# EAGLE schematic AkPlat2 (EAGLE 9.6.2)
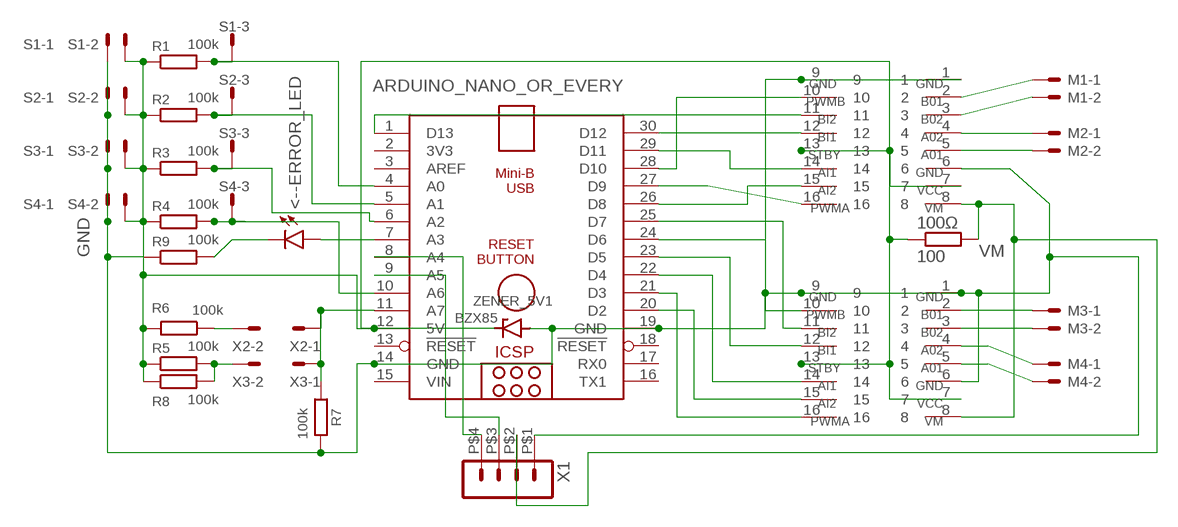
[diagram p0: schematic, sheet 1]

## Parts
100Ω  100  R-EU_0204/7  [0204/7]
<--ERROR_LED  LED3MM  [LED3MM]
ARDUINO_NANO_OR_EVERY  ARDUINO_NANO  [ARDUINO_NANO]
M1  22-23-2021  [22-23-2021]
M2  22-23-2021  [22-23-2021]
M3  22-23-2021  [22-23-2021]
M4  22-23-2021  [22-23-2021]
R1  100k  R-EU_R0402  [R0402]
R2  100k  R-EU_R0402  [R0402]
R3  100k  R-EU_R0402  [R0402]
R4  100k  R-EU_R0402  [R0402]
R5  100k  R-EU_R0402  [R0402]
R6  100k  R-EU_R0402  [R0402]
R7  100k  R-EU_R0402  [R0402]
R8  100k  R-EU_R0402  [R0402]
R9  100k  R-EU_R0402  [R0402]
S1  22-23-2031  [22-23-2031]
S2  22-23-2031  [22-23-2031]
S3  22-23-2031  [22-23-2031]
S4  22-23-2031  [22-23-2031]
U$1  CONTROLLER  [CONTROLLER]
U$2  CONTROLLER  [CONTROLLER]
X1  HEADER_POS4_43045-0412  [43045-0412]
X2  332-02  [332-02]
X3  332-02  [332-02]
ZENER_5V1  BZX85  [DO41Z10]

## Nets
5V: 100Ω.1 ARDUINO_NANO_OR_EVERY.12(5V) R1.1 R2.1 R3.1 R4.1 R5.1 R6.2 R8.1 S1.2 S2.2 S3.2 S4.2 U$1.7 U$1.13 U$2.7 U$2.13 ZENER_5V1.C
BIN2: ARDUINO_NANO_OR_EVERY.1(D13) U$1.11
GND: ARDUINO_NANO_OR_EVERY.14(GND) ARDUINO_NANO_OR_EVERY.19(GND) R7.2 R9.1 S1.1 S2.1 S3.1 S4.1 U$1.1 U$1.6 U$1.9 U$2.1 U$2.6 U$2.9 X1.P$1 ZENER_5V1.A
N$1: ARDUINO_NANO_OR_EVERY.8(A4) X1.P$4
N$2: ARDUINO_NANO_OR_EVERY.9(A5) X1.P$3
N$3: ARDUINO_NANO_OR_EVERY.27(D9) U$1.16
N$4: ARDUINO_NANO_OR_EVERY.25(D7) U$2.11
N$5: ARDUINO_NANO_OR_EVERY.30(D12) U$1.12
N$6: ARDUINO_NANO_OR_EVERY.28(D10) U$1.10
N$7: ARDUINO_NANO_OR_EVERY.29(D11) U$1.14
N$8: ARDUINO_NANO_OR_EVERY.11(A7) R7.1 X2.1 X3.1
N$9: ARDUINO_NANO_OR_EVERY.26(D8) U$1.15
N$10: ARDUINO_NANO_OR_EVERY.24(D6) U$2.10
N$11: ARDUINO_NANO_OR_EVERY.21(D3) U$2.16
N$12: ARDUINO_NANO_OR_EVERY.20(D2) U$2.15
N$13: ARDUINO_NANO_OR_EVERY.22(D4) U$2.14
N$14: ARDUINO_NANO_OR_EVERY.23(D5) U$2.12
N$15: R6.1 X2.2
N$16: M1.1 U$1.2
N$17: M1.2 U$1.3
N$18: M2.1 U$1.4
N$19: M2.2 U$1.5
N$20: M3.1 U$2.2
N$21: M3.2 U$2.3
N$22: M4.1 U$2.4
N$23: M4.2 U$2.5
N$24: R5.2 R8.2 X3.2
N$25: <--ERROR_LED.A ARDUINO_NANO_OR_EVERY.7(A3)
N$26: <--ERROR_LED.K(C) R9.2
N$32: ARDUINO_NANO_OR_EVERY.10(A6) R4.2 S4.3
N$33: ARDUINO_NANO_OR_EVERY.6(A2) R3.2 S3.3
N$34: ARDUINO_NANO_OR_EVERY.5(A1) R2.2 S2.3
N$35: ARDUINO_NANO_OR_EVERY.4(A0) R1.2 S1.3
VM: 100Ω.2 U$1.8 U$2.8 X1.P$2
Unconnected: ARDUINO_NANO_OR_EVERY.2(3V3) ARDUINO_NANO_OR_EVERY.3(AREF) ARDUINO_NANO_OR_EVERY.13(!RESET) ARDUINO_NANO_OR_EVERY.16(TX1) ARDUINO_NANO_OR_EVERY.17(RX0) ARDUINO_NANO_OR_EVERY.18(!RESET)

## Power pins joined to a net without a drawn wire
VIN: ARDUINO_NANO_OR_EVERY.15(VIN)

## Library data of the parts
100Ω R1-R9 = rcl:R-EU_: RESISTOR, European symbol; SPICEPREFIX: R
<--ERROR_LED = led:LED: LED OSRAM: - CHIPLED LG R971, LG N971, LY N971, LG Q971, LY Q971, LO R971, LY R971 LH N974, LH R974 LS Q976, LO Q976, LY Q976 LO Q996 - Hyper CHIPLED LW Q18S LB Q993, LB Q99A, LB R99A - SideLED LS A670, LO A670, LY A670, LG A670, LP A670 LB A673, LV A673, LT A673, LW A673 LH A674 LY A675 LS A676, LA A676, LO A676, LY A676, LW A676 LS A679, LY A679, LG A679 - Hyper Micro SIDELED® LS Y876, LA Y876, LO Y876, LY Y876 LT Y87S - SmartLED LW L88C, LW L88S LB L89C, LB L89S, LG L890 LS L89K, LO L89K, LY L89K LS L896, LA L896, LO L896, LY L896 - TOPLED LS T670, LO T670, LY T670, LG T670, LP T670 LSG T670, LSP T670, LSY T670, LOP T670, LYG T670 LG T671, LOG T671, LSG T671 LB T673, LV T673, LT T673, LW T673 LH T674 LS T676, LA T676, LO T676, LY T676, LB T676, LH T676, LSB T676, LW T676 LB T67C, LV T67C, LT T67C, LS T67K, LO T67K, LY T67K, LW E67C LS E67B, LA E67B, LO E67B, LY E67B, LB E67C, LV E67C, LT E67C LW T67C LS T679, LY T679, LG T679 LS T770, LO T770, LY T770, LG T770, LP T770 LB T773, LV T773, LT T773, LW T773 LH T774 LS E675, LA E675, LY E675, LS T675 LS T776, LA T776, LO T776, LY T776, LB T776 LHGB T686 LT T68C, LB T68C - Hyper Mini TOPLED® LB M676 - Mini TOPLED Santana® LG M470 LS M47K, LO M47K, LY M47K Source: http://www.osram.convergy.de LUXEON: - LUMILED® LXK2-PW12-R00, LXK2-PW12-S00, LXK2-PW14-U00, LXK2-PW14-V00 LXK2-PM12-R00, LXK2-PM12-S00, LXK2-PM14-U00 LXK2-PE12-Q00, LXK2-PE12-R00, LXK2-PE12-S00, LXK2-PE14-T00, LXK2-PE14-U00 LXK2-PB12-K00, LXK2-PB12-L00, LXK2-PB12-M00, LXK2-PB14-N00, LXK2-PB14-P00, LXK2-PB14-Q00 LXK2-PR12-L00, LXK2-PR12-M00, LXK2-PR14-Q00, LXK2-PR14-R00 LXK2-PD12-Q00, LXK2-PD12-R00, LXK2-PD12-S00 LXK2-PH12-R00, LXK2-PH12-S00 LXK2-PL12-P00, LXK2-PL12-Q00, LXK2-PL12-R00 Source: www.luxeon.com KINGBRIGHT: KA-3528ASYC Source: www.kingbright.com
ARDUINO_NANO_OR_EVERY = ArduinoNanoV30:ARDUINO_NANO: Arduino Nano V3.0 Overview: The Arduino Nano is a small, complete, and breadboard-friendly board based on the ATmega328 (Arduino Nano 3.x) or ATmega168 (Arduino Nano 2.x). It has more or less the same functionality of the Arduino Duemilanove, but in a different package. It lacks only a DC power jack, and works with a Mini-B USB cable instead of a standard one. The Nano was designed and is being produced by Gravitech. Specifications: Microcontroller Atmel ATmega168 or ATmega328 Operating Voltage (logic level) 5 V Input Voltage (recommended) 7-12 V Input Voltage (limits) 6-20 V Digital I/O Pins 14 (of which 6 provide PWM output) Analog Input Pins 8 DC Current per I/O Pin 40 mA Flash Memory 16 KB (ATmega168) or 32 KB (ATmega328) of which 2 KB used by bootloader SRAM 1 KB (ATmega168) or 2 KB (ATmega328) EEPROM 512 bytes (ATmega168) or 1 KB (ATmega328) Clock Speed 16 MHz Dimensions 0.73" x 1.70" Length 45 mm Width 18 mm Weigth 5 g Power: The Arduino Nano can be powered via the Mini-B USB connection, 6-20V unregulated external power supply (pin 30), or 5V regulated external power supply (pin 27). The power source is automatically selected to the highest voltage source. Memory: The ATmega168 has 16 KB of flash memory for storing code (of which 2 KB is used for the bootloader); the ATmega328 has 32 KB, (also with 2 KB used for the bootloader). The ATmega168 has 1 KB of SRAM and 512 bytes of EEPROM (which can be read and written with the EEPROM library); the ATmega328 has 2 KB of SRAM and 1 KB of EEPROM. Input and Output: Each of the 14 digital pins on the Nano can be used as an input or output, using pinMode(), digitalWrite(), and digitalRead() functions. They operate at 5 volts. Each pin can provide or receive a maximum of 40 mA and has an internal pull-up resistor (disconnected by default) of 20-50 kOhms. In addition, some pins have specialized functions. Visit Arduino - ArduinoBoardNano <https://www.arduino.cc/en/Main/ArduinoBoardNano>
M1-M4 = con-molex:22-23-2021: .100" (2.54mm) Center Header - 2 Pin; MF: MOLEX; MPN: 22-23-2021; OC_FARNELL: 1462926; OC_NEWARK: 25C3832
S1-S4 = con-molex:22-23-2031: .100" (2.54mm) Center Header - 3 Pin; MF: MOLEX; MPN: 22-23-2031; OC_FARNELL: 1462950; OC_NEWARK: 30C0862
U$1 U$2 = Motorcontroller:CONTROLLER
X1 = con-molex-micro-fit-3_0:HEADER_POS4_?: Molex - Micro-Fit 3.0 Series connector, 3.00mm (0.118") pitch header, 4 positions.
X2 X3 = con-garry:332-02: 2 Pin - 2mm Dual Row Source: www.mpe-connector.de / garry_shortform_2012.pdf
ZENER_5V1 = diode:BZX85: Z DIODE